# Altium schematic sheet 03-MCU.SchDoc
size A3; SheetNumber: 3; SheetTotal: 3
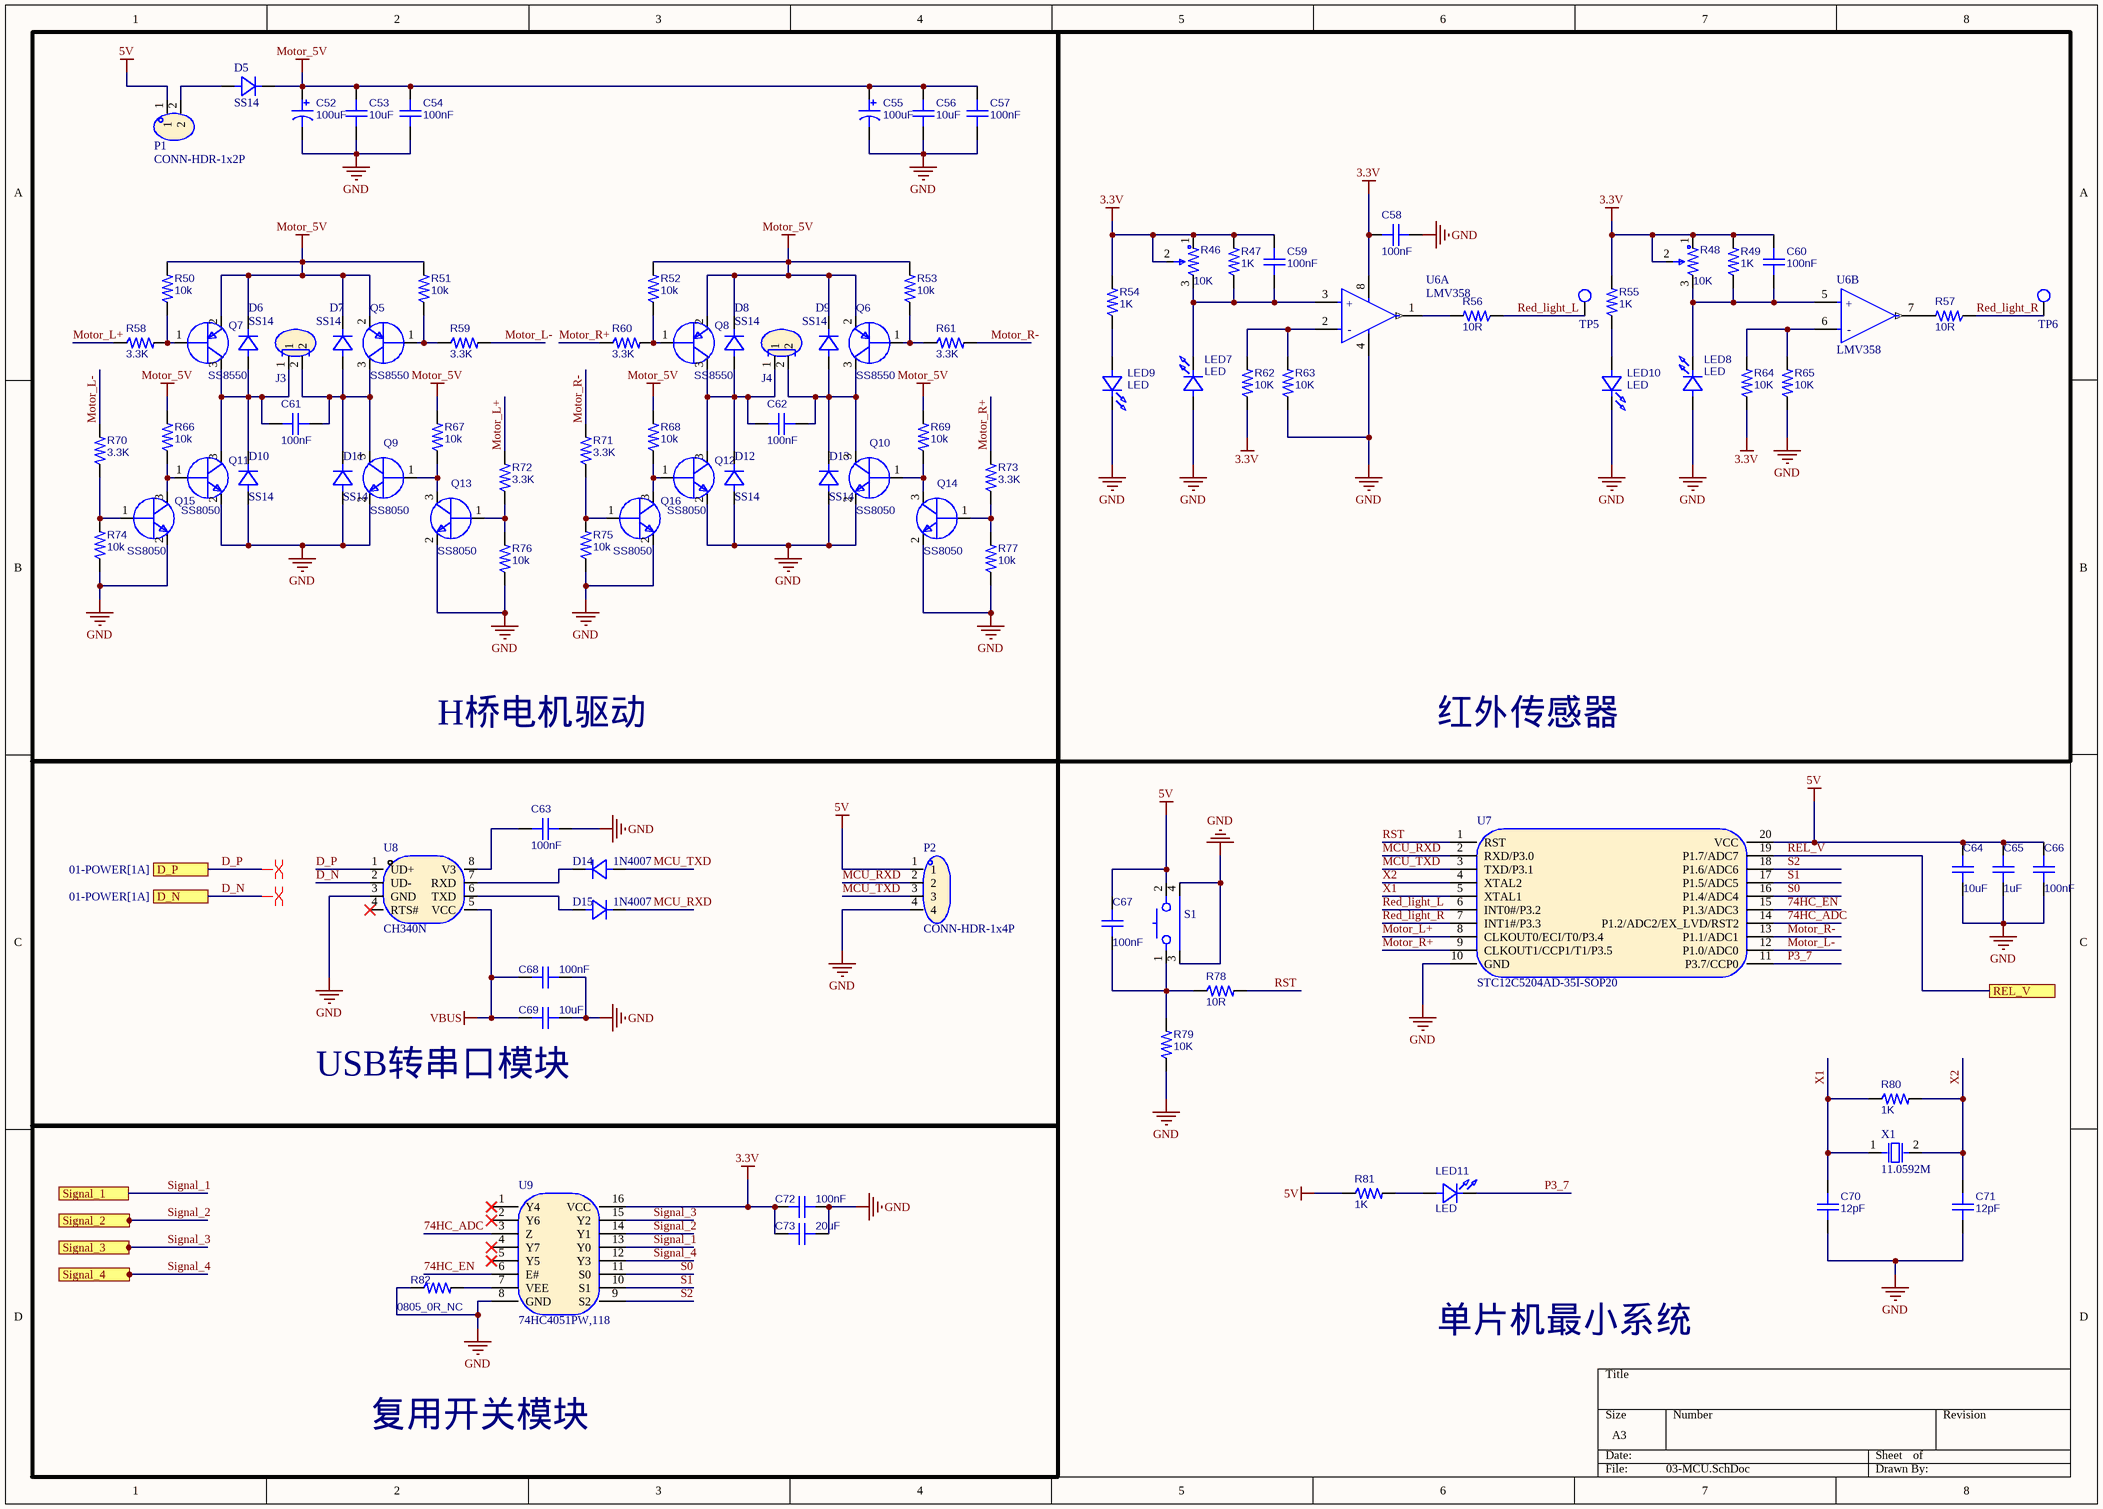
[diagram p0: 03-MCU.SchDoc]

## Parts
C52  100uF  [CAPA-TH-5020-P2.0]
C53  10uF  [CAP-SMD-0603]
C54  100nF  [CAP-SMD-0603]
C55  100uF  [CAPA-TH-5020-P2.0]
C56  10uF  [CAP-SMD-0603]
C57  100nF  [CAP-SMD-0603]
C58  100nF  [CAP-SMD-0603]
C59  100nF  [CAP-SMD-0603]
C60  100nF  [CAP-SMD-0603]
C61  100nF  [CAP-SMD-0603]
C62  100nF  [CAP-SMD-0603]
C63  100nF  [CAP-SMD-0603]
C64  10uF  [CAP-SMD-0603]
C65  1uF  [CAP-SMD-0603]
C66  100nF  [CAP-SMD-0603]
C67  100nF  [CAP-SMD-0603]
C68  100nF  [CAP-SMD-0603]
C69  10uF  [CAP-SMD-0603]
C70  12pF  [CAP-SMD-0603]
C71  12pF  [CAP-SMD-0603]
C72  100nF  [CAP-SMD-0603]
C73  20uF  [CAP-SMD-0603]
D5  SS14  [SOD-123-P3.4]
D6  SS14  [SOD-123-P3.4]
D7  SS14  [SOD-123-P3.4]
D8  SS14  [SOD-123-P3.4]
D9  SS14  [SOD-123-P3.4]
D10  SS14  [SOD-123-P3.4]
D11  SS14  [SOD-123-P3.4]
D12  SS14  [SOD-123-P3.4]
D13  SS14  [SOD-123-P3.4]
D14  1N4007  [SOD-123-P3.4]
D15  1N4007  [SOD-123-P3.4]
J3  CONN-2P  [CONN-TH-CDS-1x2P-P2.54]  (value not drawn)
J4  CONN-2P  [CONN-TH-CDS-1x2P-P2.54]  (value not drawn)
LED7  LED  [LED-TH-D5.0-P2.54]
LED8  LED  [LED-TH-D5.0-P2.54]
LED9  LED  [LED-TH-D5.0-P2.54]
LED10  LED  [LED-TH-D5.0-P2.54]
LED11  LED  [LED-SMD-0805]
P1  CONN-HDR-1x2P  [CONN-TH-1X2P-P2.54]
P2  CONN-HDR-1x4P  [CONN-TH-1X4P-P2.54]
Q5  SS8550  [SOT-23-3-LP2.28-P1.91]
Q6  SS8550  [SOT-23-3-LP2.28-P1.91]
Q7  SS8550  [SOT-23-3-LP2.28-P1.91]
Q8  SS8550  [SOT-23-3-LP2.28-P1.91]
Q9  SS8050  [SOT-23-3-LP2.28-P1.91]
Q10  SS8050  [SOT-23-3-LP2.28-P1.91]
Q11  SS8050  [SOT-23-3-LP2.28-P1.91]
Q12  SS8050  [SOT-23-3-LP2.28-P1.91]
Q13  SS8050  [SOT-23-3-LP2.28-P1.91]
Q14  SS8050  [SOT-23-3-LP2.28-P1.91]
Q15  SS8050  [SOT-23-3-LP2.28-P1.91]
Q16  SS8050  [SOT-23-3-LP2.28-P1.91]
R46  10K  [RES-TH-ADJ-3396W]
R47  1K  [RES-SMD-0603]
R48  10K  [RES-TH-ADJ-3396W]
R49  1K  [RES-SMD-0603]
R50  10k  [RES-SMD-0603]
R51  10k  [RES-SMD-0603]
R52  10k  [RES-SMD-0603]
R53  10k  [RES-SMD-0603]
R54  1K  [RES-SMD-0603]
R55  1K  [RES-SMD-0603]
R56  10R  [RES-SMD-0603]
R57  10R  [RES-SMD-0603]
R58  3.3K  [RES-SMD-0603]
R59  3.3K  [RES-SMD-0603]
R60  3.3K  [RES-SMD-0603]
R61  3.3K  [RES-SMD-0603]
R62  10K  [RES-SMD-0603]
R63  10K  [RES-SMD-0603]
R64  10K  [RES-SMD-0603]
R65  10K  [RES-SMD-0603]
R66  10k  [RES-SMD-0603]
R67  10k  [RES-SMD-0603]
R68  10k  [RES-SMD-0603]
R69  10k  [RES-SMD-0603]
R70  3.3K  [RES-SMD-0603]
R71  3.3K  [RES-SMD-0603]
R72  3.3K  [RES-SMD-0603]
R73  3.3K  [RES-SMD-0603]
R74  10k  [RES-SMD-0603]
R75  10k  [RES-SMD-0603]
R76  10k  [RES-SMD-0603]
R77  10k  [RES-SMD-0603]
R78  10R  [RES-SMD-0603]
R79  10K  [RES-SMD-0603]
R80  1K  [RES-SMD-0603]
R81  1K  [RES-SMD-0603]
R82  0805_0R_NC  [RES-SMD-0603]
S1  KEY-B-2P  [KEY-TH-B-2P]  (value not drawn)
TP5  TP  [TP]  (value not drawn)
TP6  TP  [TP]  (value not drawn)
U6  LMV358  [SOIC-8-LP5.5-P1.27]  (parts A,B of 2)
U7  STC12C5204AD-35I-SOP20  [SOP-20]
U8  CH340N  [SOP-8-LP5.3-P1.27]
U9  74HC4051PW,118  [TSSOP-16-LP5.7-P0.65]
X1  11.0592M  [OSC-5032-SMD-2P]

## Blocks framed on the sheet
H桥电机驱动: C52-C57 C61 C62 D5-D13 J3 J4 P1 Q5-Q16 R50-R53 R58-R61 R66-R77
红外传感器: C58-C60 LED7-LED10 R46-R49 R54-R57 R62-R65 TP5 TP6 U6
USB转串口模块: C63 C68 C69 D14 D15 P2 U8
复用开关模块: C72 C73 R82 U9

## Ports
D_N (see 01-POWER[1A]), D_P (see 01-POWER[1A]), REL_V (see 02-MIC[1B], 02-MIC[1D], 02-MIC[3B], 02-MIC[3D]), Signal_1 (see 02-MIC[2A]), Signal_2 (see 02-MIC[4A]), Signal_3 (see 02-MIC[2C]), Signal_4 (see 02-MIC[4C])

## Nets
3.3V: C58.2 C59.2 C60.2 C72.1 C73.1 R46.1 R46.2 R47.2 R48.1 R48.2 R49.2 R54.2 R55.2 R62.1 R64.1 U6.8(VCC+) U9.16(VCC)
5V: C64.2 C65.2 C66.2 C67.2 P1.1 P2.1 R81.1 S1.2 U7.20(VCC)
GND: C52.2 C53.1 C54.1 C55.2 C56.1 C57.1 C58.1 C63.2 C64.1 C65.1 C66.1 C68.2 C69.2 C70.1 C71.1 C72.2 C73.2 D10.1(K) D11.1(K) D12.1(K) D13.1(K) LED7.1(A) LED8.1(A) LED9.2(K) LED10.2(K) P2.4 Q9.2(E) Q10.2(E) Q11.2(E) Q12.2(E) Q13.2(E) Q14.2(E) Q15.2(E) Q16.2(E) R63.1 R65.1 R74.1 R75.1 R76.1 R77.1 R79.1 R82.1 S1.3 S1.4 U6.4(GND) U7.10(GND) U8.3(GND) U9.8(GND)
Motor_5V: C52.1 C53.2 C54.2 C55.1 C56.2 C57.2 D5.2(A) D6.2(A) D7.2(A) D8.2(A) D9.2(A) Q5.2(E) Q6.2(E) Q7.2(E) Q8.2(E) R50.2 R51.2 R52.2 R53.2 R66.2 R67.2 R68.2 R69.2
VBUS: C68.1 C69.1 U8.5(VCC)
74HC_ADC: U7.14(P1.2/ADC2/EX_LVD/RST2) U9.3(Z)
74HC_EN: U7.15(P1.3/ADC3) U9.6(E#)
D_N: U8.2(UD-) ; port D_N
D_P: U8.1(UD+) ; port D_P
MCU_RXD: D15.2(A) P2.2 U7.2(RXD/P3.0)
MCU_TXD: D14.1(K) P2.3 U7.3(TXD/P3.1)
Motor_L+: R58.1 R72.2 U7.8(CLKOUT0/ECI/T0/P3.4)
Motor_L-: R59.2 R70.2 U7.12(P1.0/ADC0)
Motor_R+: R60.1 R73.2 U7.9(CLKOUT1/CCP1/T1/P3.5)
Motor_R-: R61.2 R71.2 U7.13(P1.1/ADC1)
P3_7: LED11.2(K) U7.11(P3.7/CCP0)
Red_light_L: R56.1 TP5.1 U7.6(INT0#/P3.2)
Red_light_R: R57.1 TP6.1 U7.7(INT1#/P3.3)
REL_V: U7.19(P1.7/ADC7) ; port REL_V
RST: R78.2 U7.1(RST)
S0: U7.16(P1.4/ADC4) U9.11(S0)
S1: U7.17(P1.5/ADC5) U9.10(S1)
S2: U7.18(P1.6/ADC6) U9.9(S2)
Signal_1: U9.13(Y0) ; port Signal_1
Signal_2: U9.14(Y1) ; port Signal_2
Signal_3: U9.15(Y2) ; port Signal_3
Signal_4: U9.12(Y3) ; port Signal_4
X1: C70.2 R80.1 U7.5(XTAL1) X1.1(OSC1)
X2: C71.2 R80.2 U7.4(XTAL2) X1.2(OSC2)
NetC59_1: C59.1 LED7.2(K) R46.3 R47.1 U6.3(1IN+)
NetC60_1: C60.1 LED8.2(K) R48.3 R49.1 U6.5(1IN+)
NetC61_1: C61.1 D6.1(K) D10.2(A) J3.1 Q7.3(C) Q11.3(C)
NetC61_2: C61.2 D7.1(K) D11.2(A) J3.2 Q5.3(C) Q9.3(C)
NetC62_1: C62.1 D8.1(K) D12.2(A) J4.1 Q8.3(C) Q12.3(C)
NetC62_2: C62.2 D9.1(K) D13.2(A) J4.2 Q6.3(C) Q10.3(C)
NetC63_1: C63.1 U8.8(V3)
NetC67_1: C67.1 R78.1 R79.2 S1.1
NetD5_1: D5.1(K) P1.2
NetD14_2: D14.2(A) U8.7(RXD)
NetD15_1: D15.1(K) U8.6(TXD)
NetLED9_1: LED9.1(A) R54.1
NetLED10_1: LED10.1(A) R55.1
NetLED11_1: LED11.1(A) R81.2
NetQ5_1: Q5.1(B) R51.1 R59.1
NetQ6_1: Q6.1(B) R53.1 R61.1
NetQ7_1: Q7.1(B) R50.1 R58.2
NetQ8_1: Q8.1(B) R52.1 R60.2
NetQ9_1: Q9.1(B) Q13.3(C) R67.1
NetQ10_1: Q10.1(B) Q14.3(C) R69.1
NetQ11_1: Q11.1(B) Q15.3(C) R66.1
NetQ12_1: Q12.1(B) Q16.3(C) R68.1
NetQ13_1: Q13.1(B) R72.1 R76.2
NetQ14_1: Q14.1(B) R73.1 R77.2
NetQ15_1: Q15.1(B) R70.1 R74.2
NetQ16_1: Q16.1(B) R71.1 R75.2
NetR56_2: R56.2 U6.1(OUT)
NetR57_2: R57.2 U6.7(OUT)
NetR62_2: R62.2 R63.2 U6.2(1IN-)
NetR64_2: R64.2 R65.2 U6.6(1IN-)
NetR82_2: R82.2 U9.7(VEE)

Not connected (* = marked no-connect by the designer): U8 4(RTS#)*; U9 1(Y4)* 2(Y6)* 4(Y7)* 5(Y5)*

## Layout directives
differential pair: D_N, D_P

## Notes on the sheet
- 单片机最小系统
- (in symbol LMV358, part A) +; -
- (in symbol LMV358, part B) +; -

## Library data of the parts
C52 C55 = CAPA: 电解电容; BOM_Manufacturer: ValuePro; BOM_Manufacturer Part: 普通黑色470UF 50V; nameAlias: Capacitance; BOM_Supplier: LCSC; BOM_Supplier Part: C34642; BOM_JLCPCB Part Class: Extended Part; spicePre: C; spiceSymbolName: 470UF 50V
C53 C54 C56-C73 = CAP: 贴片电容; BOM_Manufacturer: SAMSUNG; BOM_Manufacturer Part: CL03A104KQ3NNNC; nameAlias: Capacitance; Contributor: LCSC; BOM_Supplier: LCSC; BOM_Supplier Part: C160831; BOM_JLCPCB Part Class: Extended Part; spicePre: C; spiceSymbolName: CL03A104KQ3NNNC
D5-D15 = Diode: 二极管1N4148W; Manufacturer: PSI(宝力芯); Symbol: 1N4148W_C2840890; Add into BOM: yes; Power Dissipation: 350mW; Reverse Voltage (Vr): 100V; Average Rectified Current (Io): 150mA; Forward Voltage (Vf@If): 1.25V@150mA; Reverse Leakage Current: 1A@75V; Reverse Recovery Time (trr): 4ns; Device: 1N4148W; LCSC Part Name: 100V 150mA 4ns; Supplier Part: C2840890; Manufacturer Part: 1N4148W; Supplier Footprint: SOD-123; JLCPCB Part Class: Extended Part; Datasheet: https://atta.szlcsc.com/upload/public/pdf/source/20210709/C2840890_3AF002B6505A4091F26B54E36362ABEF.pdf; Supplier: LCSC; Convert to PCB: yes; Diode Configuration: -; Operating Temperature: +150@(Tj)
J3 J4 = CONN-2P: 连接插座2pin; Manufacturer: KEFA(科发); Symbol: KF301-5.0-2P; Add into BOM: yes; Pitch: 5mm; Number of PINs Per Row: 2; Current Rating (Max): 17A; Voltage Rating (Max): 250V; Wire Gauge - AWG: 14~22; Wire Gauge - mm?: 1.5; Device: KF301-5.0-2P; LCSC Part Name: 5mm 排数:1 每排P数:2 直针 可拼接 铜 环保; Supplier Part: C474881; Manufacturer Part: KF301-5.0-2P; Supplier Footprint: P=5mm; JLCPCB Part Class: Extended Part; Datasheet: https://atta.szlcsc.com/upload/public/pdf/source/20200115/C474881_883EFE2003339C40FD1BEEEFC9A18423.pdf; Supplier: LCSC; Convert to PCB: yes; Number of Rows: 1; Mounting Style: 直针; Operating Temperature Range: -30~+120; Color: 蓝色
LED7-LED11 = LED: LED灯,发光二极管; BOM_Manufacturer: yongyu(永裕光电); BOM_Manufacturer Part: SZYY0402B; Contributor: LCSC; BOM_Supplier: LCSC; BOM_Supplier Part: C434447; spicePre: L; spiceSymbolName: SZYY0402B
P1 = CONN-HDR-1x2P: 排针1*2pin; Manufacturer: kinghelm(金航标); Symbol: KH-2.54PH180-1X2P-L11.5; Add into BOM: yes; Pitch: 2.54mm; Pin Structure: 1x2P; Circluar Pins/Square Pins: 方针; Current Rating (Max): 3A; Device: KH-2.54PH180-1X2P-L11.5; LCSC Part Name: 2.54mm 1x2P; Supplier Part: C2905434; Manufacturer Part: KH-2.54PH180-1X2P-L11.5; Supplier Footprint: 插件,P=2.54mm; JLCPCB Part Class: Extended Part; Datasheet: https://atta.szlcsc.com/upload/public/pdf/source/20211019/75EAF9E0823F75B5BB441C07BAE9F5E6.pdf; Supplier: LCSC; Convert to PCB: yes; Number of Pins: 2; Number of Rows: 1; Row Spacing: -; Mounting Type: 直插; Voltage Rating (Max): -; Length of Mating Pin: 6mm; Insulation Height: 2.5mm; Length of End Connection Pin: 3mm; Contact Material: -; Operating Temperature Range: -40~+105; Color: 黑色
P2 = CONN-HDR-1x4P: 排针1*4pin; Manufacturer: Wcon(维峰电子); Symbol: 1125-1104G0S116C001; Add into BOM: yes; Pitch: 2.54mm; Pin Structure: 1x4P; Circluar Pins/Square Pins: 方针; Current Rating (Max): 3A; Voltage Rating (Max): 320V; Device: 1125-1104G0S116C001; LCSC Part Name: 2.54mm 1x4P; Supplier Part: C920779; Manufacturer Part: 1125-1104G0S116C001; Supplier Footprint: 插件,P=2.54mm; JLCPCB Part Class: Extended Part; Datasheet: https://atta.szlcsc.com/upload/public/pdf/source/20210514/C920781_63E6ED3EFA6284A9B57E07350A5F58E4.pdf; Supplier: LCSC; Convert to PCB: yes; Number of Pins: 4; Number of Rows: 1; Row Spacing: 2.54mm; Mounting Type: 直插; Length of Mating Pin: 6.1mm; Insulation Height: 2.5mm; Length of End Connection Pin: 3mm; Contact Material: 黄铜; Contact Plating: 金; Operating Temperature Range: -40~+105; Color: 黑色
Q5-Q8 = PNP-SOT-23-3: 贴片PNP三极管; BOM_Manufacturer: YONGYUTAI(永裕泰); BOM_Manufacturer Part: S9012; Contributor: LCSC; BOM_Supplier: LCSC; BOM_Supplier Part: C2891799; BOM_JLCPCB Part Class: Extended Part; spicePre: Q; spiceSymbolName: S9012_C2891799
Q9-Q16 = NPN-SOT-23-3: 贴片NPN三极管; BOM_Manufacturer: YFW佑风微; BOM_Manufacturer Part: S9013; Contributor: LCSC; BOM_Supplier: LCSC; BOM_Supplier Part: C2898668; BOM_JLCPCB Part Class: Extended Part; spicePre: Q; spiceSymbolName: S9013_C2898668
R46 R48 = RES-ADJ: 可调电阻,电位器; BOM_Manufacturer: Chengdu Guosheng Tech; BOM_Manufacturer Part: 3362P-1-104; Resistance(Ohms): 100K; nameAlias: Resistance; Contributor: LCSC; BOM_Supplier: LCSC; BOM_Supplier Part: C118966; Resistance (Ohms): 100K; BOM_JLCPCB Part Class: Extended Part; spicePre: R; spiceSymbolName: 3362P-1-104_C118966
R47 R49-R82 = RES: 贴片电阻; BOM_Manufacturer: Chengdu Guosheng Tech; BOM_Manufacturer Part: 3362P-1-104; Resistance(Ohms): 100K; nameAlias: Resistance; Contributor: LCSC; BOM_Supplier: LCSC; BOM_Supplier Part: C118966; Resistance (Ohms): 100K; BOM_JLCPCB Part Class: Extended Part; spicePre: R; spiceSymbolName: 3362P-1-104_C118966
S1 = KEY-B-2P: 按键开关B; Manufacturer: C&K; Symbol: PTS645VL83LFS; Add into BOM: yes; Device: PTS645VL83LFS; LCSC Part Name: 轻触开关; Supplier Part: C918856; Manufacturer Part: PTS645VL83LFS; Supplier Footprint: 插件; JLCPCB Part Class: Extended Part; Datasheet: https://atta.szlcsc.com/upload/public/pdf/source/20200930/C879394_D7DA174BB86F37E4F50AF53F8B4AE402.pdf; Supplier: LCSC; Convert to PCB: yes
TP5 TP6 = TP: TP测试点
U6 = LMV358: 运放IC OPAMP GP 2 CIRCUIT 8SOIC
U7 = STC12C5204AD-35I-SOP20: CPU内核:51系列;CPU最大主频:35MHz;工作电压范围:4V~5.5V;内部振荡器:有;外部时钟频率范围:-;程序 FLASH容量:4KB;RAM总容量:256Byte;EEPROM/数据 FLASH容量:1KB;GPIO端口数量:15;ADC(单元数/通道数/位数):1@x8ch/8bit;DAC(单元数/通道数/位数):-;(E)PWM(单元数/通道数/位数):-;8位Timer数量:-;16位Timer数量:2;32位Timer数量:-;内部比较器数量:-;U(S)ART路数:1;I2C路数; Manufacturer: STC(宏晶); Add into BOM: yes; CPU Core: 51系列; Maximum Frequency: 35MHz; Internal Oscillator: 有; Program FLASH Size: 4KB; EEPROM/Data FLASH Size: 1KB; GPIO Ports Number: 15; 16Bit Timer Number: 2; U(S)ART Number: 1; Peripherals / Functions / Protocol Stacks: 低电压检测；看门狗；CCP捕获/比较; Name: STC12C5204AD-35I-SOP20; Symbol: STC12C5204AD-35I; Device: STC12C5204AD-35I-SOP20; LCSC Part Name: STC12C5204AD-35I-SOP20; Supplier Part: C8703; Manufacturer Part: STC12C5204AD-35I-SOP20; Supplier Footprint: SOIC-20_300mil; JLCPCB Part Class: 扩展库; Datasheet: https://atta.szlcsc.com/upload/public/pdf/source/20120808/1457706523764.pdf; Supplier: LCSC; Convert to PCB: yes; Supply Voltage Range: 4V~5.5V; External Clock Frequency Rang: -; RAM Size: 256Byte; ADC (Units/Channels/bits): 1@x8ch/8bit; DAC (Units/Channels/bits): -; (E)PWM (Units/Channels/bits): -; 8Bit Timer Number: -; 32Bit Timer Number: -; CMP Number: -; I2C Number: -; I2S Number: -; (Q)SPI Number: -; CAN Number: -; USB (H/D/OTG): -; Operating Temperature Range: -40~+85
U8 = CH340N: Manufacturer: WCH(南京沁恒); Symbol: CH340N_C2977777; Add into BOM: yes; Name: CH340N; Device: CH340N; LCSC Part Name: CH340N; Supplier Part: C2977777; Manufacturer Part: CH340N; Supplier Footprint: SOP-8; JLCPCB Part Class: 扩展库; Datasheet: https://atta.szlcsc.com/upload/public/pdf/source/20220223/82A45E4FF89B3EDCAD50B354450A7EF4.pdf; Supplier: LCSC; Convert to PCB: yes
U9 = 74HC4051PW,118: 复用开关IC MUX/DEMUX 8X1; Manufacturer: Nexperia(安世); Add into BOM: yes; Name: 74HC4051PW,118; Symbol: 74HC4051PW,118; Device: 74HC4051PW,118; LCSC Part Name: 74HC4051PW,118; Supplier Part: C5645; Manufacturer Part: 74HC4051PW,118; Supplier Footprint: TSSOP-16; JLCPCB Part Class: 扩展库; Datasheet: https://atta.szlcsc.com/upload/public/pdf/source/20120413/1457706470089.pdf; Supplier: LCSC; Convert to PCB: yes
X1 = XTAL-2P-WY: 无源晶振2pin; Manufacturer: YXC扬兴科技; Symbol: X49SM16MSD2SI; Add into BOM: yes; Crystal Type: 49SMD; Frequency Tolerance: ±20ppm; Frequency Stability: ±30ppm; Load Capacitance: 20pF; Equivalent Series Resistance (ESR): 40Ω; Device: X49SM16MSD2SI; LCSC Part Name: 16MHz ±20ppm 20pF; Supplier Part: C90678; Manufacturer Part: X49SM16MSD2SI; Supplier Footprint: HC-49S/SMD; JLCPCB Part Class: Extended Part; Datasheet: https://atta.szlcsc.com/upload/public/pdf/source/20210329/C106809_0E91E60850A780B284B63D653DC40EA4.pdf; Supplier: LCSC; Convert to PCB: yes; Operating Temperature: -40~+85